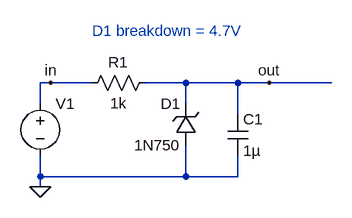
[diagram p0: schematic rc_schematic_basic.asc]
rc_schematic_basic.asc, the LTspice schematic file:
Version 4.1
SHEET 1 880 680
WIRE 80 64 64 64
WIRE 144 64 80 64
WIRE 288 64 224 64
WIRE 368 64 288 64
WIRE 416 64 368 64
WIRE 512 64 416 64
WIRE 64 96 64 64
WIRE 288 96 288 64
WIRE 368 112 368 64
WIRE 64 208 64 176
WIRE 288 208 288 160
WIRE 288 208 64 208
WIRE 368 208 368 176
WIRE 368 208 288 208
WIRE 64 224 64 208
FLAG 64 224 0
FLAG 416 64 out
FLAG 80 64 in
SYMBOL cap 352 112 R0
SYMATTR InstName C1
SYMATTR Value 1µ
SYMBOL res 240 48 R90
WINDOW 0 0 56 VBottom 2
WINDOW 3 32 56 VTop 2
SYMATTR InstName R1
SYMATTR Value 1k
SYMBOL voltage 64 80 R0
WINDOW 3 -351 57 Left 2
WINDOW 123 -350 85 Left 2
WINDOW 39 0 0 Left 0
SYMATTR Value ""
SYMATTR InstName V1
SYMBOL zener 304 160 R180
WINDOW 0 24 64 Left 2
WINDOW 3 24 0 Left 2
SYMATTR InstName D1
SYMATTR Value 1N750
TEXT 144 -16 Left 2 ;D1 breakdown = 4.7V

The netlist it stands for:
* rc_schematic_basic.asc
C1 out 0 1µ
R1 out in 1k
V1 in 0
D1 0 out 1N750
.model D D
.lib standard.dio
* D1 breakdown = 4.7V
.backanno
.end